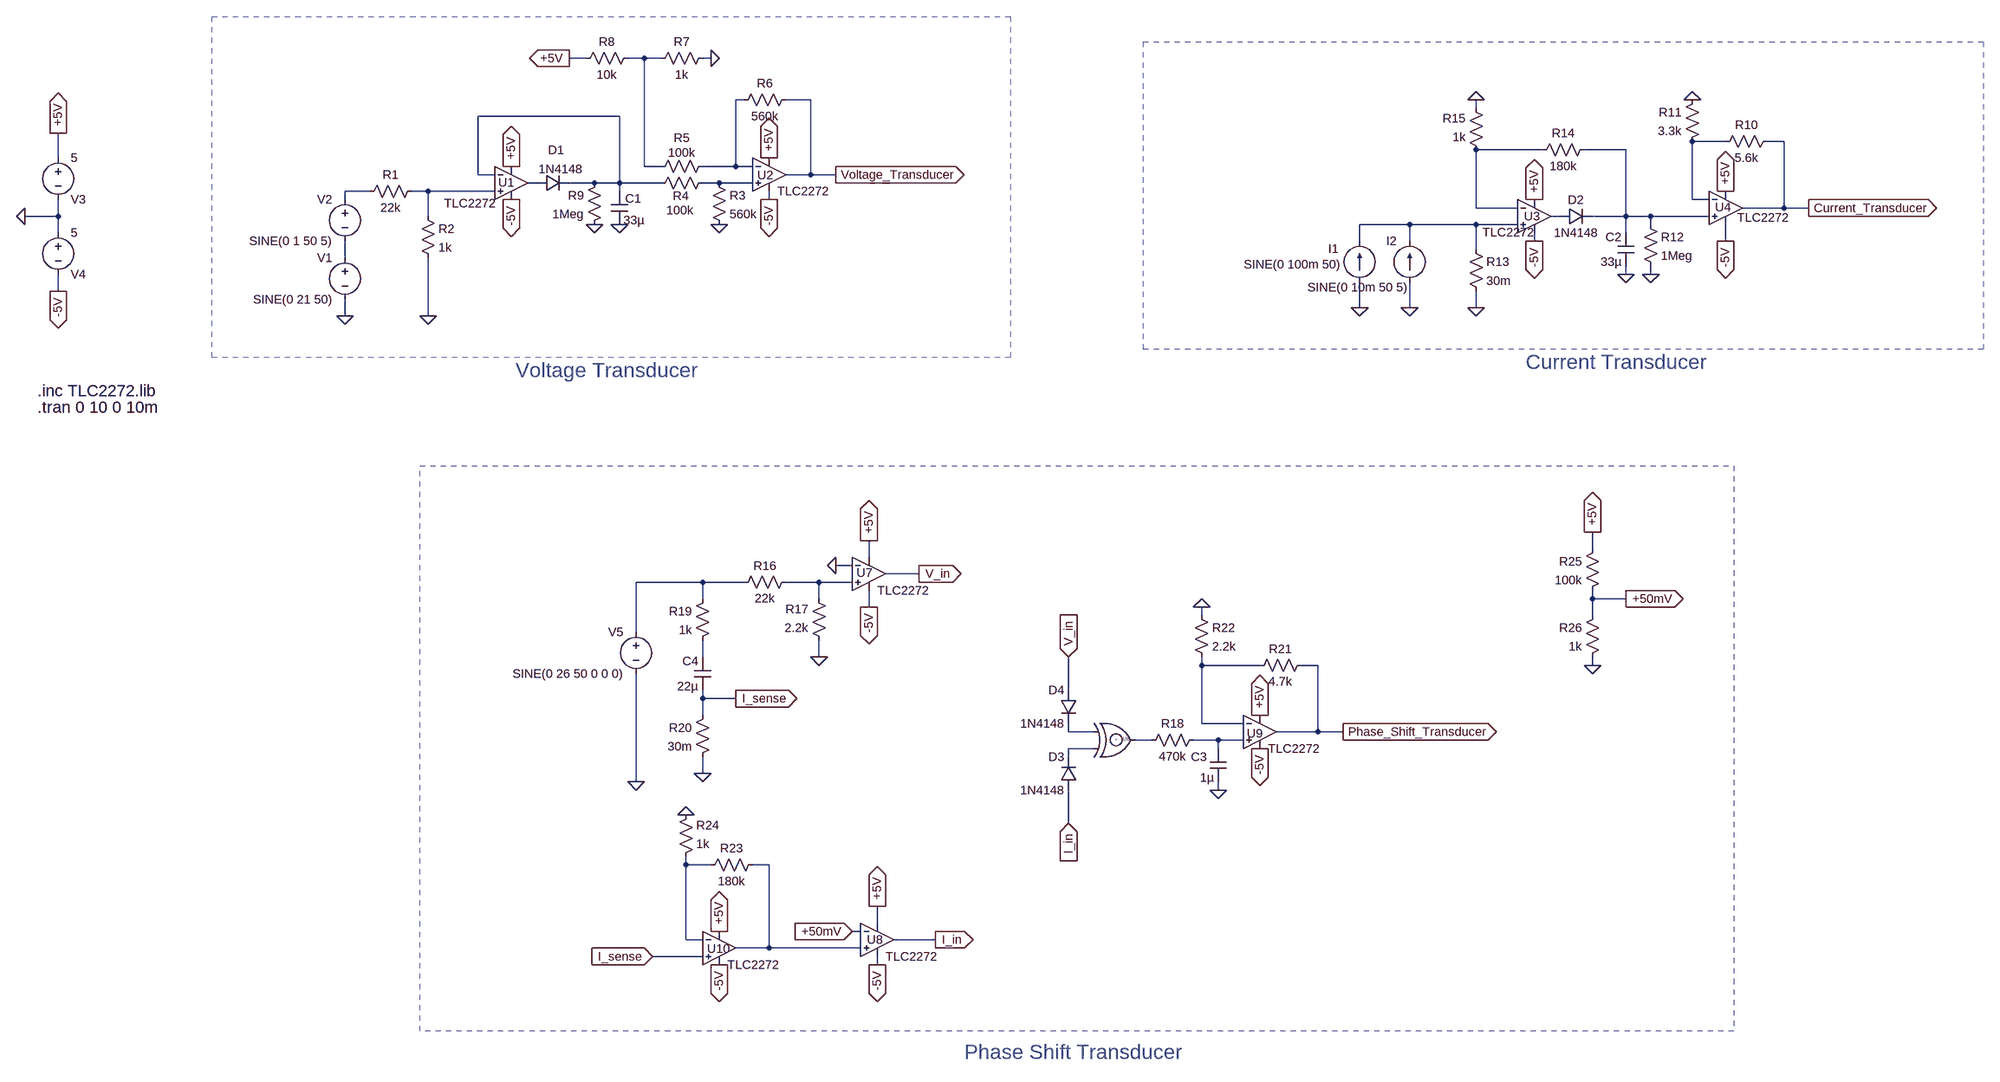
[diagram p0: schematic Muthua_21317682_A2.asc]
Muthua_21317682_A2.asc, the LTspice schematic file:
Version 4
SHEET 1 2148 1780
WIRE -544 -160 -576 -160
WIRE -432 -160 -464 -160
WIRE -400 -160 -432 -160
WIRE -304 -160 -320 -160
WIRE -240 -80 -256 -80
WIRE -112 -80 -160 -80
WIRE 1168 -64 1168 -80
WIRE -480 -48 -752 -48
WIRE 1648 0 1584 0
WIRE 1760 0 1728 0
WIRE 1296 16 1168 16
WIRE 1456 16 1376 16
WIRE -1648 32 -1648 -16
WIRE -432 48 -432 -160
WIRE -400 48 -432 48
WIRE -256 48 -256 -80
WIRE -256 48 -320 48
WIRE -224 48 -256 48
WIRE -752 64 -752 -48
WIRE -720 64 -752 64
WIRE -112 64 -112 -80
WIRE -112 64 -160 64
WIRE -64 64 -112 64
WIRE -640 80 -656 80
WIRE -528 80 -576 80
WIRE -480 80 -480 -48
WIRE -480 80 -528 80
WIRE -400 80 -480 80
WIRE -288 80 -320 80
WIRE -224 80 -288 80
WIRE -960 96 -1008 96
WIRE -848 96 -880 96
WIRE -720 96 -848 96
WIRE -480 96 -480 80
WIRE -1008 112 -1008 96
WIRE -192 112 -192 96
WIRE 1584 112 1584 0
WIRE 1616 112 1584 112
WIRE 1168 128 1168 16
WIRE 1248 128 1168 128
WIRE 1760 128 1760 0
WIRE 1760 128 1680 128
WIRE 1808 128 1760 128
WIRE -1648 144 -1648 112
WIRE -1648 144 -1712 144
WIRE -848 144 -848 96
WIRE 1328 144 1312 144
WIRE 1456 144 1456 16
WIRE 1456 144 1392 144
WIRE 1504 144 1456 144
WIRE 1616 144 1504 144
WIRE 1040 160 944 160
WIRE 1168 160 1040 160
WIRE 1248 160 1168 160
WIRE 1504 160 1504 144
WIRE -1648 176 -1648 144
WIRE 1456 176 1456 144
WIRE 944 192 944 160
WIRE 1040 192 1040 160
WIRE 1280 192 1280 176
WIRE 1648 192 1648 160
WIRE 1168 208 1168 160
WIRE -1008 224 -1008 192
WIRE 1456 256 1456 240
WIRE 1504 256 1504 240
WIRE -1648 288 -1648 256
WIRE 944 320 944 272
WIRE 1040 320 1040 272
WIRE 1168 320 1168 288
WIRE -1008 336 -1008 304
WIRE -848 336 -848 224
WIRE 1392 784 1392 752
WIRE 0 800 0 768
WIRE -32 816 -64 816
WIRE 96 832 32 832
WIRE -320 848 -448 848
WIRE -240 848 -320 848
WIRE -96 848 -160 848
WIRE -32 848 -96 848
WIRE -320 880 -320 848
WIRE -96 880 -96 848
WIRE 1392 880 1392 864
WIRE 1456 880 1392 880
WIRE 0 896 0 864
WIRE 640 912 640 896
WIRE 1392 912 1392 880
WIRE -448 944 -448 848
WIRE -320 992 -320 960
WIRE -96 992 -96 960
WIRE 640 1008 640 992
WIRE 752 1008 640 1008
WIRE 864 1008 832 1008
WIRE 1392 1008 1392 992
WIRE 384 1056 384 992
WIRE -320 1072 -320 1056
WIRE -256 1072 -320 1072
WIRE -320 1104 -320 1072
WIRE 640 1120 640 1008
WIRE 720 1120 640 1120
WIRE 384 1136 384 1120
WIRE 432 1136 384 1136
WIRE 864 1136 864 1008
WIRE 864 1136 784 1136
WIRE 912 1136 864 1136
WIRE 544 1152 512 1152
WIRE 672 1152 624 1152
WIRE 720 1152 672 1152
WIRE 432 1168 384 1168
WIRE 672 1168 672 1152
WIRE 384 1184 384 1168
WIRE -320 1216 -320 1184
WIRE -448 1232 -448 1024
WIRE 672 1248 672 1232
WIRE 384 1312 384 1248
WIRE -352 1392 -352 1376
WIRE -304 1392 -352 1392
WIRE -192 1392 -224 1392
WIRE 16 1504 16 1472
WIRE -16 1520 -32 1520
WIRE -352 1536 -352 1392
WIRE -320 1536 -352 1536
WIRE 128 1536 48 1536
WIRE -192 1552 -192 1392
WIRE -192 1552 -256 1552
WIRE -16 1552 -192 1552
WIRE -320 1568 -416 1568
WIRE 16 1584 16 1568
FLAG -480 160 0
FLAG -848 336 0
FLAG -1008 336 0
FLAG -288 160 0
FLAG -304 -160 0
FLAG -528 160 0
FLAG -1648 -16 +5V
IOPIN -1648 -16 Out
FLAG -688 48 +5V
IOPIN -688 48 Out
FLAG -192 32 +5V
IOPIN -192 32 Out
FLAG -1712 144 0
FLAG -1648 288 -5V
IOPIN -1648 288 Out
FLAG -688 112 -5V
IOPIN -688 112 Out
FLAG -192 112 -5V
IOPIN -192 112 Out
FLAG -576 -160 +5V
IOPIN -576 -160 Out
FLAG -64 64 Voltage_Transducer
IOPIN -64 64 Out
FLAG 1456 256 0
FLAG 1584 -80 0
FLAG 1504 256 0
FLAG 1168 320 0
FLAG 1168 -80 0
FLAG 1040 320 0
FLAG 944 320 0
FLAG 1280 112 +5V
IOPIN 1280 112 Out
FLAG 1648 96 +5V
IOPIN 1648 96 Out
FLAG 1280 192 -5V
IOPIN 1280 192 Out
FLAG 1648 192 -5V
IOPIN 1648 192 Out
FLAG 1808 128 Current_Transducer
IOPIN 1808 128 Out
FLAG -448 1232 0
FLAG -96 992 0
FLAG 672 1248 0
FLAG -320 1216 0
FLAG 640 896 0
FLAG -352 1296 0
FLAG 1392 1008 0
FLAG -64 816 0
FLAG 752 1104 +5V
IOPIN 752 1104 Out
FLAG 16 1472 +5V
IOPIN 16 1472 Out
FLAG -288 1520 +5V
IOPIN -288 1520 Out
FLAG 1392 752 +5V
IOPIN 1392 752 Out
FLAG 752 1168 -5V
IOPIN 752 1168 Out
FLAG 16 1584 -5V
IOPIN 16 1584 Out
FLAG -288 1584 -5V
IOPIN -288 1584 Out
FLAG 0 768 +5V
IOPIN 0 768 Out
FLAG 0 896 -5V
IOPIN 0 896 Out
FLAG 1456 880 +50mV
IOPIN 1456 880 Out
FLAG -32 1520 +50mV
IOPIN -32 1520 In
FLAG 96 832 V_in
IOPIN 96 832 Out
FLAG 128 1536 I_in
IOPIN 128 1536 Out
FLAG 384 992 V_in
IOPIN 384 992 In
FLAG 384 1312 I_in
IOPIN 384 1312 In
FLAG -256 1072 I_sense
IOPIN -256 1072 Out
FLAG -416 1568 I_sense
IOPIN -416 1568 In
FLAG 912 1136 Phase_Shift_Transducer
IOPIN 912 1136 Out
SYMBOL voltage -1008 208 M0
WINDOW 123 0 0 Left 0
WINDOW 39 0 0 Left 0
SYMATTR InstName V1
SYMATTR Value SINE(0 21 50)
SYMBOL Opamps\\opamp2 -688 16 R0
WINDOW 0 -25 63 Left 2
WINDOW 3 -129 103 Left 2
SYMATTR InstName U1
SYMATTR Value TLC2272
SYMATTR SpiceModel TLC2272
SYMBOL Opamps\\opamp2 -192 0 R0
WINDOW 0 -23 65 Left 2
SYMATTR InstName U2
SYMATTR Value TLC2272
SYMATTR SpiceModel TLC2272
SYMBOL diode -640 96 R270
WINDOW 0 64 38 VTop 2
WINDOW 3 58 47 VBottom 2
SYMATTR InstName D1
SYMATTR Value 1N4148
SYMBOL cap -496 96 R0
WINDOW 0 27 14 Left 2
SYMATTR InstName C1
SYMATTR Value 33µ
SYMBOL res -864 80 R90
WINDOW 0 0 56 VBottom 2
WINDOW 3 32 56 VTop 2
SYMATTR InstName R1
SYMATTR Value 22k
SYMBOL res -864 128 R0
SYMATTR InstName R2
SYMATTR Value 1k
SYMBOL voltage -1008 96 M0
WINDOW 123 0 0 Left 0
WINDOW 39 0 0 Left 0
SYMATTR InstName V2
SYMATTR Value SINE(0 1 50 5)
SYMBOL res -304 64 R0
SYMATTR InstName R3
SYMATTR Value 560k
SYMBOL res -304 64 R90
WINDOW 0 57 58 VBottom 2
WINDOW 3 53 59 VTop 2
SYMATTR InstName R4
SYMATTR Value 100k
SYMBOL res -304 32 R90
WINDOW 0 -23 56 VBottom 2
WINDOW 3 -26 56 VTop 2
SYMATTR InstName R5
SYMATTR Value 100k
SYMBOL res -144 -96 R90
WINDOW 0 0 56 VBottom 2
WINDOW 3 32 56 VTop 2
SYMATTR InstName R6
SYMATTR Value 560k
SYMBOL res -304 -176 R90
WINDOW 0 0 56 VBottom 2
WINDOW 3 32 56 VTop 2
SYMATTR InstName R7
SYMATTR Value 1k
SYMBOL res -448 -176 R90
WINDOW 0 0 56 VBottom 2
WINDOW 3 32 56 VTop 2
SYMATTR InstName R8
SYMATTR Value 10k
SYMBOL res -512 64 M0
SYMATTR InstName R9
SYMATTR Value 1Meg
SYMBOL voltage -1648 16 R0
WINDOW 0 24 96 Left 2
WINDOW 3 24 16 Left 2
WINDOW 123 0 0 Left 0
WINDOW 39 0 0 Left 0
SYMATTR InstName V3
SYMATTR Value 5
SYMBOL voltage -1648 160 R0
WINDOW 0 24 96 Left 2
WINDOW 3 24 16 Left 2
WINDOW 123 0 0 Left 0
WINDOW 39 0 0 Left 0
SYMATTR InstName V4
SYMATTR Value 5
SYMBOL Opamps\\opamp2 1280 80 R0
WINDOW 0 -20 64 Left 2
WINDOW 3 -100 95 Left 2
SYMATTR InstName U3
SYMATTR Value TLC2272
SYMATTR SpiceModel TLC2272
SYMBOL Opamps\\opamp2 1648 64 R0
WINDOW 0 -20 63 Left 2
WINDOW 3 22 83 Left 2
SYMATTR InstName U4
SYMATTR Value TLC2272
SYMATTR SpiceModel TLC2272
SYMBOL diode 1328 160 R270
WINDOW 0 32 32 VTop 2
WINDOW 3 0 32 VBottom 2
SYMATTR InstName D2
SYMATTR Value 1N4148
SYMBOL cap 1472 176 M0
SYMATTR InstName C2
SYMATTR Value 33µ
SYMBOL res 1744 -16 R90
WINDOW 0 0 56 VBottom 2
WINDOW 3 32 56 VTop 2
SYMATTR InstName R10
SYMATTR Value 5.6k
SYMBOL res 1600 -96 M0
SYMATTR InstName R11
SYMATTR Value 3.3k
SYMBOL res 1488 144 R0
SYMATTR InstName R12
SYMATTR Value 1Meg
SYMBOL res 1152 192 R0
SYMATTR InstName R13
SYMATTR Value 30m
SYMBOL current 944 272 R180
WINDOW 0 40 65 Left 2
WINDOW 3 36 35 Left 2
WINDOW 123 0 0 Left 0
WINDOW 39 0 0 Left 0
SYMATTR InstName I1
SYMATTR Value SINE(0 100m 50)
SYMBOL current 1040 272 R180
WINDOW 0 24 80 Left 2
WINDOW 3 3 -9 Left 2
WINDOW 123 0 0 Left 0
WINDOW 39 0 0 Left 0
SYMATTR InstName I2
SYMATTR Value SINE(0 10m 50 5)
SYMBOL res 1392 0 R90
WINDOW 0 0 56 VBottom 2
WINDOW 3 32 56 VTop 2
SYMATTR InstName R14
SYMATTR Value 180k
SYMBOL res 1184 32 R180
WINDOW 0 36 76 Left 2
WINDOW 3 36 40 Left 2
SYMATTR InstName R15
SYMATTR Value 1k
SYMBOL voltage -448 928 M0
WINDOW 123 0 0 Left 0
WINDOW 39 0 0 Left 0
SYMATTR InstName V5
SYMATTR Value SINE(0 26 50 0 0 0)
SYMBOL XOR_2 480 1152 R0
WINDOW 0 9 -2 Left 0
SYMATTR InstName U6
SYMBOL Opamps\\opamp2 0 768 R0
WINDOW 0 -24 62 Left 2
SYMATTR InstName U7
SYMATTR Value TLC2272
SYMATTR SpiceModel TLC2272
SYMBOL Opamps\\opamp2 16 1472 R0
WINDOW 0 -20 64 Left 2
SYMATTR InstName U8
SYMATTR Value TLC2272
SYMATTR SpiceModel TLC2272
SYMBOL res -144 832 R90
WINDOW 0 0 56 VBottom 2
WINDOW 3 32 56 VTop 2
SYMATTR InstName R16
SYMATTR Value 22k
SYMBOL res -80 976 R180
WINDOW 0 36 76 Left 2
WINDOW 3 36 40 Left 2
SYMATTR InstName R17
SYMATTR Value 2.2k
SYMBOL cap 688 1232 R180
WINDOW 0 38 48 Left 2
WINDOW 3 24 8 Left 2
SYMATTR InstName C3
SYMATTR Value 1µ
SYMBOL res 640 1136 R90
WINDOW 0 0 56 VBottom 2
WINDOW 3 32 56 VTop 2
SYMATTR InstName R18
SYMATTR Value 470k
SYMBOL res -304 864 M0
SYMATTR InstName R19
SYMATTR Value 1k
SYMBOL res -304 1088 M0
SYMATTR InstName R20
SYMATTR Value 30m
SYMBOL Opamps\\opamp2 752 1072 R0
WINDOW 0 -25 67 Left 2
SYMATTR InstName U9
SYMATTR Value TLC2272
SYMATTR SpiceModel TLC2272
SYMBOL res 848 992 R90
WINDOW 0 0 56 VBottom 2
WINDOW 3 32 56 VTop 2
SYMATTR InstName R21
SYMATTR Value 4.7k
SYMBOL res 624 896 R0
SYMATTR InstName R22
SYMATTR Value 2.2k
SYMBOL Opamps\\opamp2 -288 1488 R0
WINDOW 0 -23 65 Left 2
SYMATTR InstName U10
SYMATTR Value TLC2272
SYMATTR SpiceModel TLC2272
SYMBOL res -208 1376 R90
WINDOW 0 0 56 VBottom 2
WINDOW 3 32 56 VTop 2
SYMATTR InstName R23
SYMATTR Value 180k
SYMBOL res -368 1392 M180
WINDOW 0 36 76 Left 2
WINDOW 3 36 40 Left 2
SYMATTR InstName R24
SYMATTR Value 1k
SYMBOL diode 400 1248 R180
WINDOW 0 24 64 Left 2
WINDOW 3 24 0 Left 2
SYMATTR InstName D3
SYMATTR Value 1N4148
SYMBOL diode 400 1056 M0
SYMATTR InstName D4
SYMATTR Value 1N4148
SYMBOL res 1408 768 M0
SYMATTR InstName R25
SYMATTR Value 100k
SYMBOL res 1408 896 M0
SYMATTR InstName R26
SYMATTR Value 1k
SYMBOL cap -304 992 M0
SYMATTR InstName C4
SYMATTR Value 22µ
TEXT -680 440 Left 4 ;Voltage Transducer
TEXT 1264 424 Left 4 ;Current Transducer
TEXT 184 1752 Left 4 ;Phase Shift Transducer
TEXT -1688 512 Left 3 !.tran 0 10 0 10m
TEXT -1688 480 Left 3 !.inc TLC2272.lib
RECTANGLE Normal 272 416 -1264 -240 3
RECTANGLE Normal 2144 400 528 -192 3
RECTANGLE Normal 1664 1712 -864 624 3

The netlist it stands for:
* Muthua_21317682_A2.asc
V1 N013 0 SINE(0 21 50)
XU1 N010 N003 +5V -5V N007 TLC2272 TLC2272  ; pins In+ In- V+ V- OUT
XU2 N008 N002 +5V -5V Voltage_Transducer TLC2272 TLC2272  ; pins In+ In- V+ V- OUT
D1 N007 N003 1N4148
C1 N003 0 33µ
R1 N010 N009 22k
R2 N010 0 1k
V2 N009 N013 SINE(0 1 50 5)
R3 N008 0 560k
R4 N008 N003 100k
R5 N002 N001 100k
R6 Voltage_Transducer N002 560k
R7 0 N001 1k
R8 N001 +5V 10k
R9 N003 0 1Meg
V3 +5V 0 5
V4 0 -5V 5
XU3 N012 N005 +5V -5V N011 TLC2272 TLC2272  ; pins In+ In- V+ V- OUT
XU4 N006 N004 +5V -5V Current_Transducer TLC2272 TLC2272  ; pins In+ In- V+ V- OUT
D2 N011 N006 1N4148
C2 N006 0 33µ
R10 Current_Transducer N004 5.6k
R11 0 N004 3.3k
R12 N006 0 1Meg
R13 N012 0 30m
I1 0 N012 SINE(0 100m 50)
I2 0 N012 SINE(0 10m 50 5)
R14 N006 N005 180k
R15 N005 0 1k
V5 N014 0 SINE(0 26 50 0 0 0)
XU6 N018 N021 N019 XOR_2  ; pins in1 in2 q
XU7 N015 0 +5V -5V V_in TLC2272 TLC2272  ; pins In+ In- V+ V- OUT
XU8 N023 +50mV +5V -5V I_in TLC2272 TLC2272  ; pins In+ In- V+ V- OUT
R16 N015 N014 22k
R17 0 N015 2.2k
C3 0 N020 1µ
R18 N020 N019 470k
R19 N014 N016 1k
R20 I_sense 0 30m
XU9 N020 N017 +5V -5V Phase_Shift_Transducer TLC2272 TLC2272  ; pins In+ In- V+ V- OUT
R21 Phase_Shift_Transducer N017 4.7k
R22 0 N017 2.2k
XU10 I_sense N022 +5V -5V N023 TLC2272 TLC2272  ; pins In+ In- V+ V- OUT
R23 N023 N022 180k
R24 N022 0 1k
D3 I_in N021 1N4148
D4 V_in N018 1N4148
R25 +5V +50mV 100k
R26 +50mV 0 1k
C4 N016 I_sense 22µ
.model D D
.lib standard.dio
* Voltage Transducer
* Current Transducer
* Phase Shift Transducer
.tran 0 10 0 10m
.inc TLC2272.lib
.lib DigitalLogic.lib
.backanno
.end